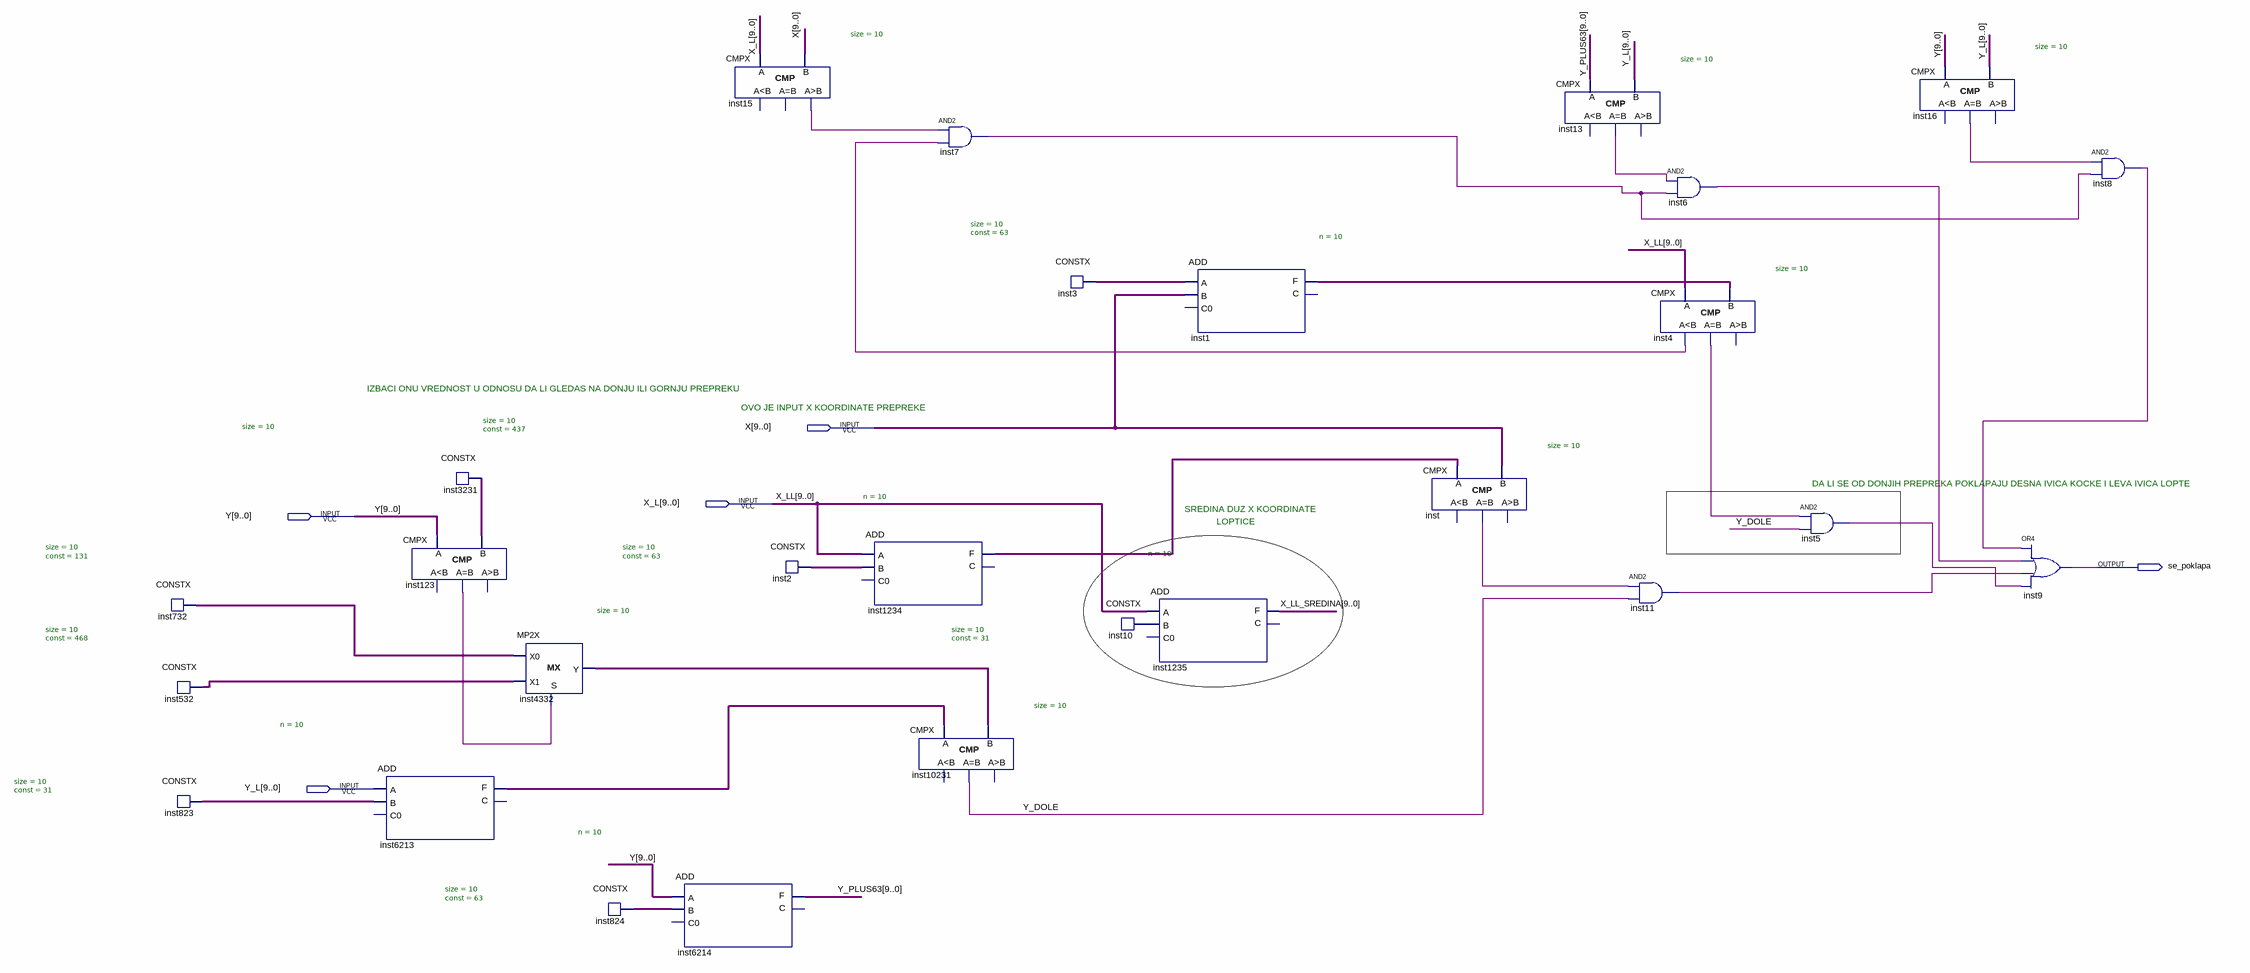
[diagram p0: schematic sheet]
// Quartus schematic ivice_prepreka.bdf as structural Verilog: 27 symbols, 5 pins
module ivice_prepreka (
  input  [9:0] X,
  input  [9:0] X_L,
  input  [9:0] Y,
  input  [9:0] Y_L,
  output se_poklapa
);

  wire inst4_eq, inst4_ls, inst5_out, inst6_out, inst7_out, inst8_out, inst11_out, inst13_eq, inst15_gr,
       inst16_eq, inst123_eq, inst_eq, Y_DOLE;
  wire [9:0] inst1_f, inst2_data, inst3_data, inst10_data, inst532_data, inst732_data, inst823_data,
       inst824_data, inst1234_f, inst3231_data, inst4332_y, inst6213_f, X_LL_SREDINA, Y_PLUS63;

  CONSTX #(.size(10), .\const (131)) inst732 (.data(inst732_data));
  CONSTX #(.size(10), .\const (468)) inst532 (.data(inst532_data));
  CONSTX #(.size(10), .\const (31)) inst823 (.data(inst823_data));
  CMPX #(.size(10)) inst123 (.A(Y), .B(inst3231_data), .eq(inst123_eq));  // open: ls, gr
  ADD #(.n(10)) inst6213 (.A(Y_L), .B(inst823_data), .F(inst6213_f));  // open: C0, C
  CONSTX #(.size(10), .\const (437)) inst3231 (.data(inst3231_data));
  MP2X #(.size(10)) inst4332 (.S(inst123_eq), .X0(inst732_data), .X1(inst532_data), .Y(inst4332_y));
  CONSTX #(.size(10), .\const (63)) inst824 (.data(inst824_data));
  ADD #(.n(10)) inst6214 (.A(Y), .B(inst824_data), .F(Y_PLUS63));  // open: C0, C
  CMPX #(.size(10)) inst15 (.A(X_L), .B(X), .gr(inst15_gr));  // open: ls, eq
  CONSTX #(.size(10), .\const (63)) inst2 (.data(inst2_data));
  ADD #(.n(10)) inst1234 (.A(X_L), .B(inst2_data), .F(inst1234_f));  // open: C0, C
  CMPX #(.size(10)) inst10231 (.A(inst6213_f), .B(inst4332_y), .eq(Y_DOLE));  // open: ls, gr
  and inst7 (inst7_out, inst15_gr, inst4_ls);
  CONSTX #(.size(10), .\const (63)) inst3 (.data(inst3_data));
  CONSTX #(.size(10), .\const (31)) inst10 (.data(inst10_data));
  ADD #(.n(10)) inst1235 (.A(X_L), .B(inst10_data), .F(X_LL_SREDINA));  // open: C0, C
  ADD #(.n(10)) inst1 (.A(inst3_data), .B(X), .F(inst1_f));  // open: C0, C
  CMPX #(.size(10)) inst (.A(inst1234_f), .B(X), .eq(inst_eq));  // open: ls, gr
  CMPX #(.size(10)) inst13 (.A(Y_PLUS63), .B(Y_L), .eq(inst13_eq));  // open: ls, gr
  and inst6 (inst6_out, inst13_eq, inst7_out);
  CMPX #(.size(10)) inst4 (.A(X_L), .B(inst1_f), .ls(inst4_ls), .eq(inst4_eq));  // open: gr
  and inst11 (inst11_out, inst_eq, Y_DOLE);
  and inst5 (inst5_out, inst4_eq, Y_DOLE);
  CMPX #(.size(10)) inst16 (.A(Y), .B(Y_L), .eq(inst16_eq));  // open: ls, gr
  or inst9 (se_poklapa, inst8_out, inst6_out, inst11_out, inst5_out);
  and inst8 (inst8_out, inst16_eq, inst7_out);

  // Other names for the same wires on the sheet: X_LL[9:0] = X_L

  // Notes on the sheet:
  //   IZBACI ONU VREDNOST U ODNOSU DA LI GLEDAS NA DONJU ILI GORNJU PREPREKU
  //   OVO JE INPUT X KOORDINATE PREPREKE
  //   DA LI SE OD DONJIH PREPREKA POKLAPAJU DESNA IVICA KOCKE I LEVA IVICA LOPTE
  //   SREDINA DUZ X KOORDINATE 
  //   LOPTICE
endmodule
